# Altium project GD_AirIrDA.PrjPcb
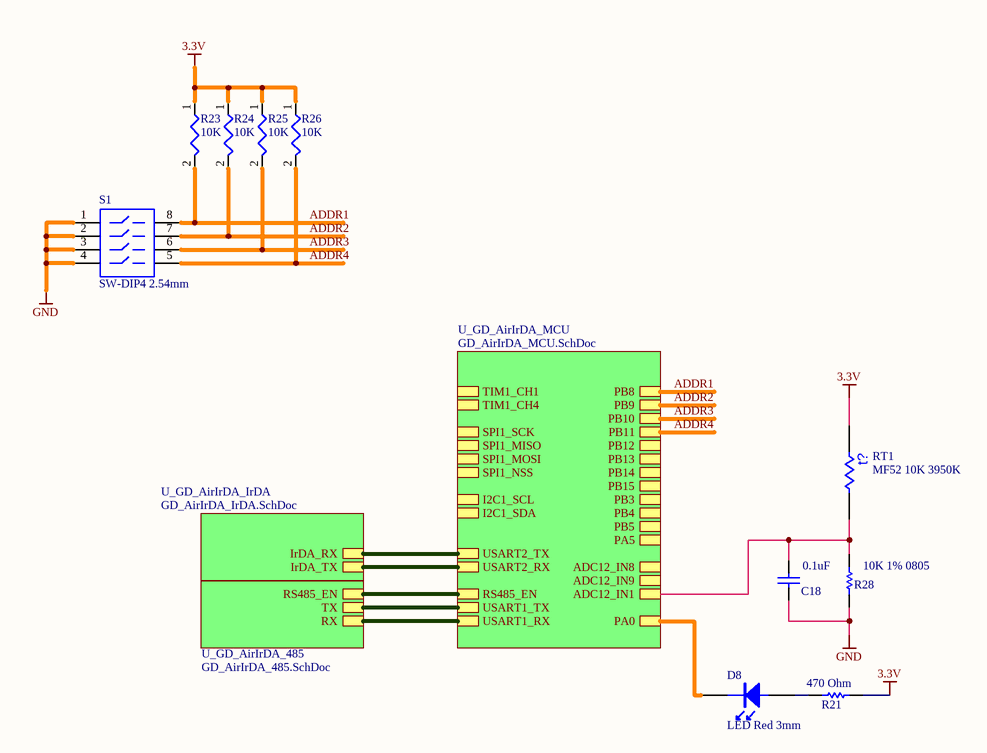
[diagram p0: GD_AirIrDA_Top.SchDoc]
4 sheets, 75 parts. Net scope: hierarchical (ports join the sheet entries above them; power ports are global).
Board file: GD_AirIrDA.PcbDoc
Sheets:
  GD_AirIrDA_Top.SchDoc
    U_GD_AirIrDA_MCU = GD_AirIrDA_MCU.SchDoc
    U_GD_AirIrDA_485 = GD_AirIrDA_485.SchDoc
    U_GD_AirIrDA_IrDA = GD_AirIrDA_IrDA.SchDoc

## Sheet GD_AirIrDA_Top.SchDoc
size A4

### Parts
C18  value 0.1uF  [CAPC0805(2012)100_N]  (hidden comment: CAP 0.1uF 20% 50V 0805)
D8  LED Red 3mm  [LED_DIP]
R21  value 470 Ohm  [RESC0805(2012)_L]  (hidden comment: 470 Ohm 5% 0805)
R23  value 10K  [R0805]  (hidden comment: 10K 5% 0805)
R24  value 10K  [R0805]  (hidden comment: 10K 5% 0805)
R25  value 10K  [R0805]  (hidden comment: 10K 5% 0805)
R26  value 10K  [R0805]  (hidden comment: 10K 5% 0805)
R28  10K 1% 0805  [RESC0805(2012)_L]
RT1  MF52 10K 3950K  [NTC-MF52]
S1  SW-DIP4 2.54mm  [SW_4P]

### Sub-sheets
U_GD_AirIrDA_485 = GD_AirIrDA_485.SchDoc: RS485_EN, TX, RX
U_GD_AirIrDA_IrDA = GD_AirIrDA_IrDA.SchDoc: IrDA_TX, IrDA_RX
U_GD_AirIrDA_MCU = GD_AirIrDA_MCU.SchDoc: USART1_TX, USART1_RX, USART2_TX, USART2_RX, TIM1_CH1, TIM1_CH4, SPI1_SCK, SPI1_MISO, SPI1_MOSI, SPI1_NSS, I2C1_SCL, I2C1_SDA, ADC12_IN8, ADC12_IN9, ADC12_IN1, RS485_EN, PB8, PB9, PB10, PB11, PB12, PB13, PB14, PB15, PB3, PB4, PB5, PA5, PA0

### Nets
3.3V: R21.2 R23.1 R24.1 R25.1 R26.1 RT1.1
GND: C18.1 R28.2 S1.1 S1.2 S1.3 S1.4
ADDR1: R23.2 S1.8 ; sheet U_GD_AirIrDA_MCU/PB8
ADDR2: R24.2 S1.7 ; sheet U_GD_AirIrDA_MCU/PB9
ADDR3: R25.2 S1.6 ; sheet U_GD_AirIrDA_MCU/PB10
ADDR4: R26.2 S1.5 ; sheet U_GD_AirIrDA_MCU/PB11
NetC18_2: C18.2 R28.1 RT1.2 ; sheet U_GD_AirIrDA_MCU/ADC12_IN1
NetD8_1: D8.1 R21.1
NetD8_2: D8.2 ; sheet U_GD_AirIrDA_MCU/PA0
NetR11_2: sheet U_GD_AirIrDA_MCU/RS485_EN, sheet U_GD_AirIrDA_485/RS485_EN
NetR22_2: sheet U_GD_AirIrDA_MCU/USART2_TX, sheet U_GD_AirIrDA_IrDA/IrDA_RX
NetU1_13: sheet U_GD_AirIrDA_MCU/USART2_RX, sheet U_GD_AirIrDA_IrDA/IrDA_TX
NetU1_30: sheet U_GD_AirIrDA_MCU/USART1_TX, sheet U_GD_AirIrDA_485/TX
NetU1_31: sheet U_GD_AirIrDA_MCU/USART1_RX, sheet U_GD_AirIrDA_485/RX

### Notes on the sheet
- (in symbol Res Thermal) t?

### Library data of the parts
C18 = CMP-1036-00070-1: CAP 0.1uF 50V ±20% 0805 (2012 Metric) Thickness 1mm SMD; Case-Metric: 2012; Case-EIA: 0805; Tolerance: 20%; Rated Voltage: 50 V; Technology: SMT; Max Thickness: 1 mm
D8 = LED
R21 = CMP-1013-00098-1: 470Ohm 0.125W 5% 0805 (2012 Metric)  SMD; Case-EIA: 0805; Case-Metric: 2012; Power: 0.125 W; Technology: SMT; Tolerance: 5 %
R23-R26 = ER00213: RES THICK_FILM SMD 10K ohm 5% 1/10W ROHS 0603; Manufacturer: YAGEO; Manufacturer P/N: RC0603JR-1310KL; ID: 213; HelpURL: \\192.168.1.3\Esh\Department\RD\CAD\Component\Resistor\SMD\YAGEO_PYu-RC1206_51_RoHS_L_4.pdf; P/N: ER00213
R28 = CMP-1013-00098-1: 10K 0.125W 5% 0805 (2012 Metric)  SMD; Case-EIA: 0805; Case-Metric: 2012; Value: 10000.00 Ohm; Power: 0.125 W; Technology: SMT; Tolerance: 1 %
RT1 = Res Thermal: Thermistor; Published: 24-Mar-1999; LatestRevisionDate: 29-May-2009; LatestRevisionNote: IPC-7351 Footprint Added.; PackageVersion: Mar-2003; PackageReference: 6-0805; Publisher: Altium Limited; PackageDescription: Chip Resistor 0805 Case Size; Code_IPC: RESC2012
S1 = SW-DIP4: 侧拨 4位; Manufacturer: WE; Manufacturer P/N: 418317270904; P/N: EE00004; Published: 24-Mar-1999; LatestRevisionDate: 17-Jul-2002; LatestRevisionNote: Re-released for DXP Platform.; PackageReference: DIP-8; Publisher: Altium Limited

## Sheet GD_AirIrDA_MCU.SchDoc
size A4
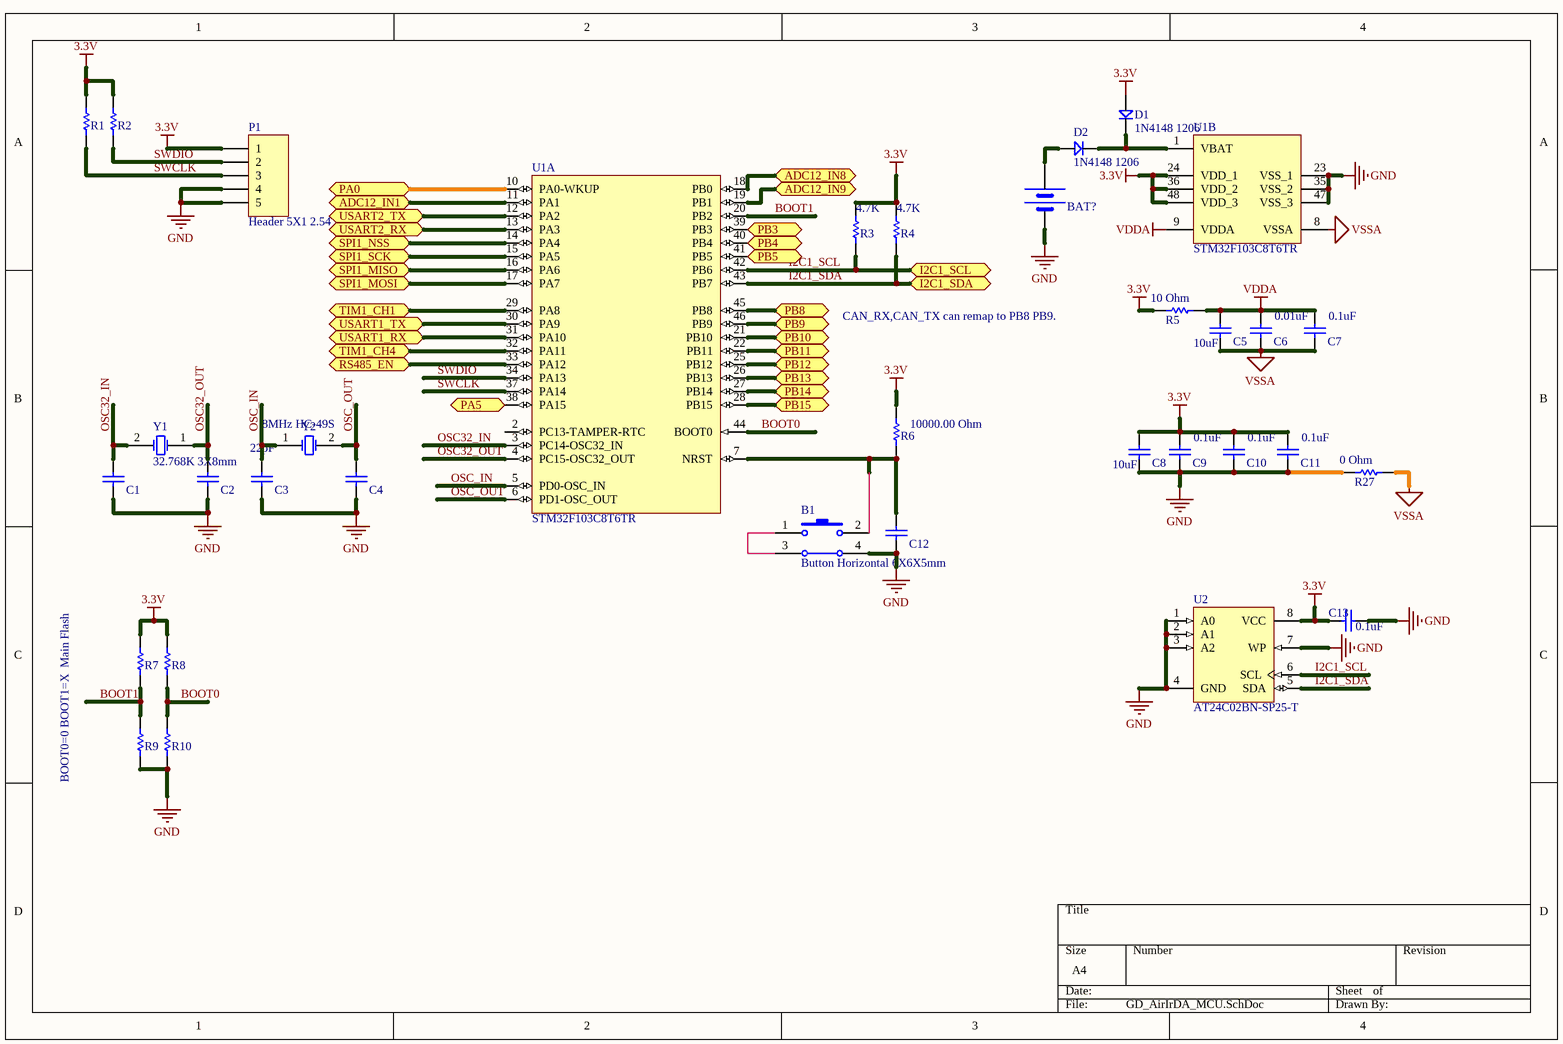
[diagram p1: GD_AirIrDA_MCU.SchDoc]

### Parts
B1  Button Horizontal 6X6X5mm  [Button_V]
BAT?  CR1220 Sockect SMD  [BATM]  (value not drawn)
C1  CAP 22pF 5% 50V 0805  [CAPC0805(2012)75_M]  (value not drawn)
C2  CAP 22pF 5% 50V 0805  [CAPC0805(2012)75_M]  (value not drawn)
C3  value 22pF  [CAPC0805(2012)75_M]  (hidden comment: CAP 22pF 5% 50V 0805)
C4  CAP 22pF 5% 50V 0805  [CAPC0805(2012)75_M]  (value not drawn)
C5  value 10uF  [CAPC1210(3225)170_N]  (hidden comment: CAP 10uF 20% 10V 1210)
C6  value 0.01uF  [CAPC0805(2012)100_N]  (hidden comment: CAP 0.1uF 20% 50V 0805)
C7  value 0.1uF  [CAPC0805(2012)100_N]  (hidden comment: CAP 0.1uF 20% 50V 0805)
C8  value 10uF  [CAPC1210(3225)170_N]  (hidden comment: CAP 10uF 20% 10V 1210)
C9  value 0.1uF  [CAPC0805(2012)100_N]  (hidden comment: CAP 0.1uF 20% 50V 0805)
C10  value 0.1uF  [CAPC0805(2012)100_N]  (hidden comment: CAP 0.1uF 20% 50V 0805)
C11  value 0.1uF  [CAPC0805(2012)100_N]  (hidden comment: CAP 0.1uF 20% 50V 0805)
C12  CAP 0.1uF 20% 50V 0805  [CAPC0805(2012)100_N]  (value not drawn)
C13  value 0.1uF  [CAPC0805(2012)100_N]  (hidden comment: CAP 0.1uF 20% 50V 0805)
D1  1N4148 1206  [DIODE_SOP]
D2  1N4148 1206  [DIODE_SOP]
P1  Header 5X1 2.54  [HDR1X5]
R1  10K 5% 0805  [RESC0805(2012)_L]  (value not drawn)
R2  10K 5% 0805  [RESC0805(2012)_L]  (value not drawn)
R3  value 4.7K  [RESC0805(2012)_L]  (hidden comment: 4.7K 5% 0805)
R4  value 4.7K  [RESC0805(2012)_L]  (hidden comment: 4.7K 5% 0805)
R5  value 10 Ohm  [RESC0805(2012)_L]  (hidden comment: 10Ohm 5% 0805)
R6  value 10000.00 Ohm  [RESC0805(2012)_L]  (hidden comment: 10K 5% 0805)
R7  10K 5% 0805  [RESC0805(2012)_L]  (value not drawn)  (no BOM)
R8  10K 5% 0805  [RESC0805(2012)_L]  (value not drawn)  (no BOM)
R9  10K 5% 0805  [RESC0805(2012)_L]  (value not drawn)  (no BOM)
R10  10K 5% 0805  [RESC0805(2012)_L]  (value not drawn)
R27  value 0 Ohm  [RESC0805(2012)_L]  (hidden comment: 0 Ohm 5% 0805)
U1  STM32F103C8T6TR  [STM-LQFP48_M]  (parts A,B of 2)
U2  AT24C02BN-SP25-T  [8S1_L]
Y1  32.768K 3X8mm  [XTAL32]
Y2  8MHz HC-49S  [XTAL_US]

### Ports
ADC12_IN1, ADC12_IN8, ADC12_IN9, I2C1_SCL, I2C1_SDA, PA0, PA5, PB3, PB4, PB5, PB8, PB9, PB10, PB11, PB12, PB13, PB14, PB15, RS485_EN, SPI1_MISO, SPI1_MOSI, SPI1_NSS, SPI1_SCK, TIM1_CH1, TIM1_CH4, USART1_RX, USART1_TX, USART2_RX, USART2_TX

### Nets
3.3V: C8.2 C9.2 C10.2 C11.2 C13.2 D1.1 P1.1 R1.1 R2.1 R3.1 R4.1 R5.1 R6.1 R7.1 R8.1 U1.24(VDD_1) U1.36(VDD_2) U1.48(VDD_3) U2.8(VCC)
GND: B1.4 BAT?.2(GND) C1.2 C2.1 C3.1 C4.1 C8.1 C9.1 C10.1 C11.1 C12.1 C13.1 P1.4 P1.5 R9.2 R10.2 R27.1 U1.23(VSS_1) U1.35(VSS_2) U1.47(VSS_3) U2.1(A0) U2.2(A1) U2.3(A2) U2.4(GND) U2.7(WP)
VDDA: C5.2 C6.2 C7.2 R5.2 U1.9(VDDA)
VSSA: C5.1 C6.1 C7.1 R27.2 U1.8(VSSA)
ADDR1: U1.45(PB8) ; port PB8
ADDR2: U1.46(PB9) ; port PB9
ADDR3: U1.21(PB10) ; port PB10
ADDR4: U1.22(PB11) ; port PB11
BOOT0: R8.2 R10.1 U1.44(BOOT0)
BOOT1: R7.2 R9.1 U1.20(PB2)
I2C1_SCL: R3.2 U1.42(PB6) U2.6(SCL) ; port I2C1_SCL
I2C1_SDA: R4.2 U1.43(PB7) U2.5(SDA) ; port I2C1_SDA
OSC32_IN: C1.1 U1.3(PC14-OSC32_IN) Y1.2(OSC2)
OSC32_OUT: C2.2 U1.4(PC15-OSC32_OUT) Y1.1(OSC1)
OSC_IN: C3.2 U1.5(PD0-OSC_IN) Y2.1(OSC1)
OSC_OUT: C4.2 U1.6(PD1-OSC_OUT) Y2.2(OSC2)
SWCLK: P1.3 R1.2 U1.37(PA14)
SWDIO: P1.2 R2.2 U1.34(PA13)
NetB1_1: B1.1 B1.3
NetB1_2: B1.2 C12.2 R6.2 U1.7(NRST)
NetBAT?_1: BAT?.1(VCC) D2.1
NetC18_2: U1.11(PA1) ; port ADC12_IN1
NetD1_2: D1.2 D2.2 U1.1(VBAT)
NetD8_2: U1.10(PA0-WKUP) ; port PA0
NetR11_2: U1.33(PA12) ; port RS485_EN
NetR22_2: U1.12(PA2) ; port USART2_TX
NetU1_13: U1.13(PA3) ; port USART2_RX
NetU1_14: U1.14(PA4) ; port SPI1_NSS
NetU1_15: U1.15(PA5) ; port SPI1_SCK
NetU1_16: U1.16(PA6) ; port SPI1_MISO
NetU1_17: U1.17(PA7) ; port SPI1_MOSI
NetU1_18: U1.18(PB0) ; port ADC12_IN8
NetU1_19: U1.19(PB1) ; port ADC12_IN9
NetU1_25: U1.25(PB12) ; port PB12
NetU1_26: U1.26(PB13) ; port PB13
NetU1_27: U1.27(PB14) ; port PB14
NetU1_28: U1.28(PB15) ; port PB15
NetU1_29: U1.29(PA8) ; port TIM1_CH1
NetU1_30: U1.30(PA9) ; port USART1_TX
NetU1_31: U1.31(PA10) ; port USART1_RX
NetU1_32: U1.32(PA11) ; port TIM1_CH4
NetU1_38: U1.38(PA15) ; port PA5
NetU1_39: U1.39(PB3) ; port PB3
NetU1_40: U1.40(PB4) ; port PB4
NetU1_41: U1.41(PB5) ; port PB5

Not connected (* = marked no-connect by the designer): U1 2(PC13-TAMPER-RTC)

### Notes on the sheet
- CAN_RX,CAN_TX can remap to PB8 PB9.
- BOOT0=0 BOOT1=X  Main Flash

### Library data of the parts
B1 = ES00012: Button ON/OFF，11.85MM,DIP-4; Manufacturer P/N: TVSE-21L; Manufacturer: HUA JIE; ID: 12; Value: TVSE-21L; P/N: ES00012; HelpURL: \\192.168.1.3\Esh\Department\RD\CAD\Component\TSVX-X1L规格120214.pdf
BAT? = BAT
C1-C4 = CMP-1036-01234-1: CAP 22pF 50V ±1% 0805 (2012 Metric) Thickness 0.75mm SMD; Case-EIA: 0805; Case-Metric: 2012; Rated Voltage: 50 V; Tolerance: ±1%; Technology: SMT; Max Thickness: 0.75 mm
  C1 C2 C4: Value: 22pF
C5 C8 = CMP-1038-02199-1: CAP 10uF 10V ±20% 1210 (3225 Metric) Thickness 1.7mm SMD; Case-Metric: 3225; Case-EIA: 1210; Technology: SMT; Rated Voltage: 10 V; Tolerance: ±20%; Max Thickness: 1.7 mm
C6 C7 C9-C13 = CMP-1036-00070-1: as C18 on sheet GD_AirIrDA_Top; Tolerance: 20%; Rated Voltage: 50 V; Technology: SMT; Max Thickness: 1 mm
  C12: Value: 0.1uF
D1 D2 = D: 1N4148
P1 = Header 5: Header, 5-Pin; LatestRevisionDate: 17-Jul-2002; LatestRevisionNote: Re-released for DXP Platform.; Publisher: Altium Limited
R1 R2 R7-R10 = CMP-1013-00098-1: as R28 on sheet GD_AirIrDA_Top; Power: 0.125 W; Technology: SMT; Tolerance: 5 %
R3 R4 = CMP-1013-00098-1: 4.7K 0.125W 5% 0805 (2012 Metric)  SMD; Case-EIA: 0805; Case-Metric: 2012; Power: 0.125 W; Technology: SMT; Tolerance: 5 %
R5 R27 = CMP-1013-00098-1: 10Ohm 0.125W 5% 0805 (2012 Metric)  SMD; Case-EIA: 0805; Case-Metric: 2012; Power: 0.125 W; Technology: SMT; Tolerance: 5 %
R6 = CMP-1013-00098-1: 10K 0.125W 5% 0805 (2012 Metric)  SMD; Case-EIA: 0805; Case-Metric: 2012; Power: 0.125 W; Technology: SMT; Tolerance: 5 %
U1 = CMP-0237-00216-3: ARM Cortex-M3 32-bit MCU, 64 KB Flash, 20 KB Internal RAM, 37 I/Os, 48-pin LQFP, -40 to 85 degC, Tape and Reel; A/D Converter: 2x12-bit (10 Channel); Internal RAM Size (kB): 20; Supply Voltage(Vcc) min (V): 2; I/Os (High Current): 37; FLASH Size (Prog) (kB): 64; Operating Frequency(F) (Processor speed) (MHz): 72; Packing: Tape and Reel; PackageReference: LQFP48; ComponentLink2Description: Datasheet; Core: ARM Cortex-M3; ComponentLink3URL: http://www.st.com/st-web-ui/static/active/en/resource/technical/document/datasheet/DM00058181.pdf; ComponentLink1Description: Manufacturer URL; ComponentLink3Description: Package Specification; PartNumber: STM32F103C8T6TR; PackageVersion: Rev. 6, 06/2013; ComponentLink2URL: http://www.st.com/st-web-ui/static/active/en/resource/technical/document/datasheet/CD00161566.pdf; PackageDescription: 48-Pin Low Profile Quad Flat Package, 7 x 7 mm Body, 0.5 mm Pitch; Mounting Technology: Surface Mount; DatasheetVersion: Rev. 16; ComponentLink1URL: http://www.st.com/web/en/home.html
U2 = CMP-0152-00023-1: 2Kbit (256 x 8), 2-wire Bus Automotive Serial EEPROM with full memory Write Protect, 2.5V, 8-Pin SOIC, Tape & Reel; PackageDescription: 8-Lead (0.150" Wide Body), Plastic Gull Wing Small Outline (JEDEC SOIC); Code_IPC: SOIC127P600-8; PackageReference: 8S1; DatasheetVersion: 8517C,  Jan-2009; Code_JEDEC: MS-012-AA; PackageVersion: revC, Mar-2005
Y1 = XTAL_1: 32.768K 3mmX8mm; Published: 8-Jun-2000; LatestRevisionDate: 17-Jul-2002; LatestRevisionNote: Re-released for DXP Platform.; Publisher: Altium Limited
Y2 = XTAL: Published: 8-Jun-2000; LatestRevisionDate: 17-Jul-2002; LatestRevisionNote: Re-released for DXP Platform.; Publisher: Altium Limited

## Sheet GD_AirIrDA_485.SchDoc
size A4
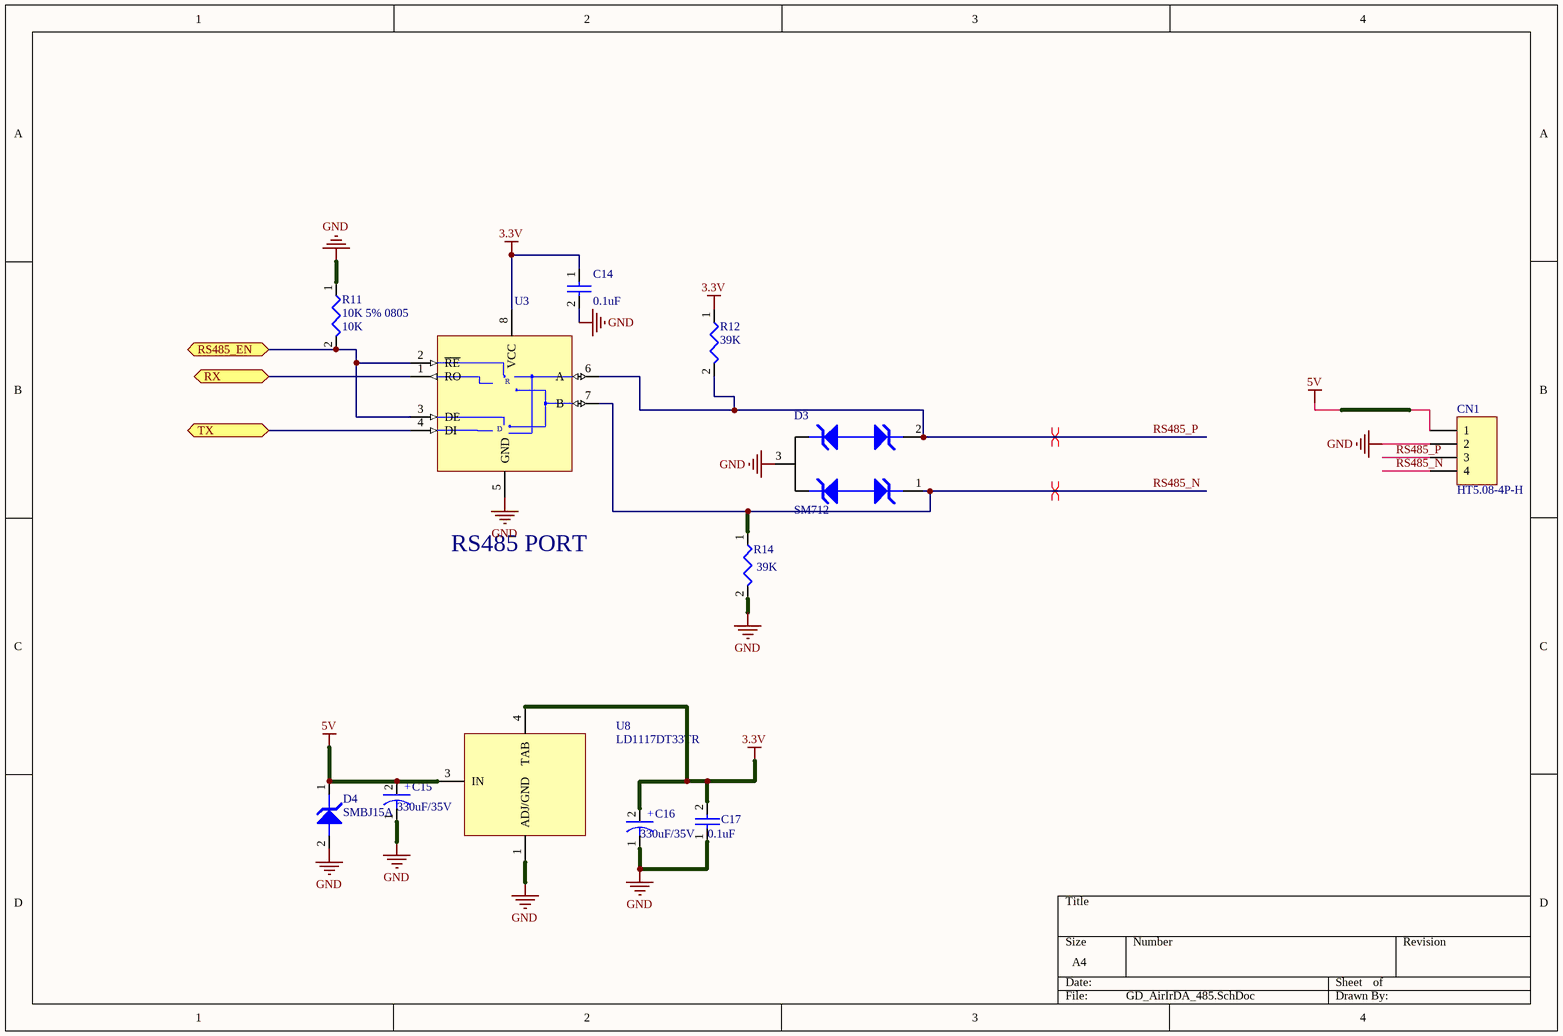
[diagram p2: GD_AirIrDA_485.SchDoc]

### Parts
C14  value 0.1uF  [C0805]  (hidden comment: CAP 0.1uF 20% 50V 0805)
C15  value 330uF/35V  [CA10X16P5]  (hidden comment: CAPACITOR 330uF 20% 35V 10mmX16mm)
C16  value 330uF/35V  [CA10X16P5]  (hidden comment: CAPACITOR 330uF 20% 35V 10mmX16mm)
C17  value 0.1uF  [C0805]  (hidden comment: CAP 0.1uF 20% 50V 0805)
CN1  HT5.08-4P-H  [HT5.08-4P-H]
D3  SM712  [SOT23-123]
D4  SMBJ15A  [SMB]
R11  10K 5% 0805  value 10K  [R0805]
R12  value 39K  [R0805]  (hidden comment: 39K 5% 0805)  (no BOM)
R14  value 39K  [R0805]  (hidden comment: 39K 5% 0805)  (no BOM)
U3  SN65HVD08D  [SOIC8]  (value not drawn)
U8  LD1117DT33TR  [DPAK-134]

### Ports
RS485_EN, RX, TX

### Nets
3.3V: C14.1 C16.2 C17.2 R12.1 U3.8(VCC) U8.4(TAB)
5V: C15.2 CN1.1 D4.1 U8.3(IN)
GND: C14.2 C15.1 C16.1 C17.1 CN1.2 D3.3 D4.2 R11.1 R14.2 U3.5(GND) U8.1(ADJ/GND)
RS485_N: CN1.4 D3.1 R14.1 U3.7(B)
RS485_P: CN1.3 D3.2 R12.2 U3.6(A)
NetR11_2: R11.2 U3.2(~{RE}) U3.3(DE) ; port RS485_EN
NetU1_30: U3.4(DI) ; port TX
NetU1_31: U3.1(RO) ; port RX

### Layout directives
differential pair: RS485_N, RS485_P

### Notes on the sheet
- RS485 PORT
- (in symbol EC00095) +
- (in symbol EU00041) R; D

### Library data of the parts
C14 C17 = EC00014: CAP SMD CR X7R 50V 10% 0.1uF 0805 ROHS; Manufacturer: YAGEO; Manufacturer P/N: CC0805KRX7R9BB104; ID: 14; HelpURL: *; P/N: EC00014
C15 C16 = EC00095: CAP 35V 20% 330uF 10X16X0.6MM ROHS，7000hours; Manufacturer: NIPPON CHEMI-CON; Manufacturer P/N: EKY350ELL331MJ16S; ID: 95; Type: ****; HelpURL: \\192.168.1.3\Esh\Department\RD\CAD\Component\Capacitor\KY(105).pdf; P/N: EC00095
CN1 = Header 4: Header, 4-Pin; Manufacturer P/N: HT5.08-4 Bend; P/N: EE00005; Manufacturer: *
D3 = ED00007: DIODE TVS 7V 12V 17A 400W SOT-23 SMD ROHS; Manufacturer: BOURNS; ID: 7; Value: CDSOT23-SM712; Type: ****; HelpURL: \\192.168.1.3\Esh\Department\RD\CAD\Component\IO_PROTECTION\BOURNS_CDSOT23-SM712.pdf; P/N: ED00007; Manufacturer P/N: CDSOT23-SM712
D4 = ED00032: Manufacturer: Bourns; P/N: EE00002; Type: ****; Manufacturer P/N: SMBJ15A; Value: SMBJ15A
R11 = ER00213: as R23 on sheet GD_AirIrDA_Top; HelpURL: \\192.168.1.3\Esh\Department\RD\CAD\Component\Resistor\SMD\YAGEO_PYu-RC1206_51_RoHS_L_4.pdf; P/N: ER00213
R12 R14 = ER00021: RES THICK_FILM SMD 39K 5% 1/8W ROHS 0805; Manufacturer: YAGEO; Manufacturer P/N: RC0805JR-0739KL; ID: 21; HelpURL: *; P/N: ER00021
U3 = EU00041: IC 5V,RS-485,10Mbps,16KV,TRANSCEIVERS,SOIC-8,ROHS; Manufacturer: Texas Instruments; ID: 41; HelpURL: \\192.168.1.3\Esh\Department\RD\CAD\Component\RS485\sn65hvd08.pdf; P/N: EU00041; Manufacturer P/N: SN65HVD08D; Value: SN65HVD08D; Type: *****
U8 = EU00066: IC REG VOLT +3.3V LDO 800MA DPAK ROHS; Manufacturer: ST; ID: 66; Value: LD1117-3.3; P/N: EU00066; HelpURL: \\192.168.1.3\Esh\Department\RD\CAD\Component\Power_DC_to_DC\LD1117_ST.pdf; Manufacturer P/N: LD1117DT33TR; Type: *****

## Sheet GD_AirIrDA_IrDA.SchDoc
size A4
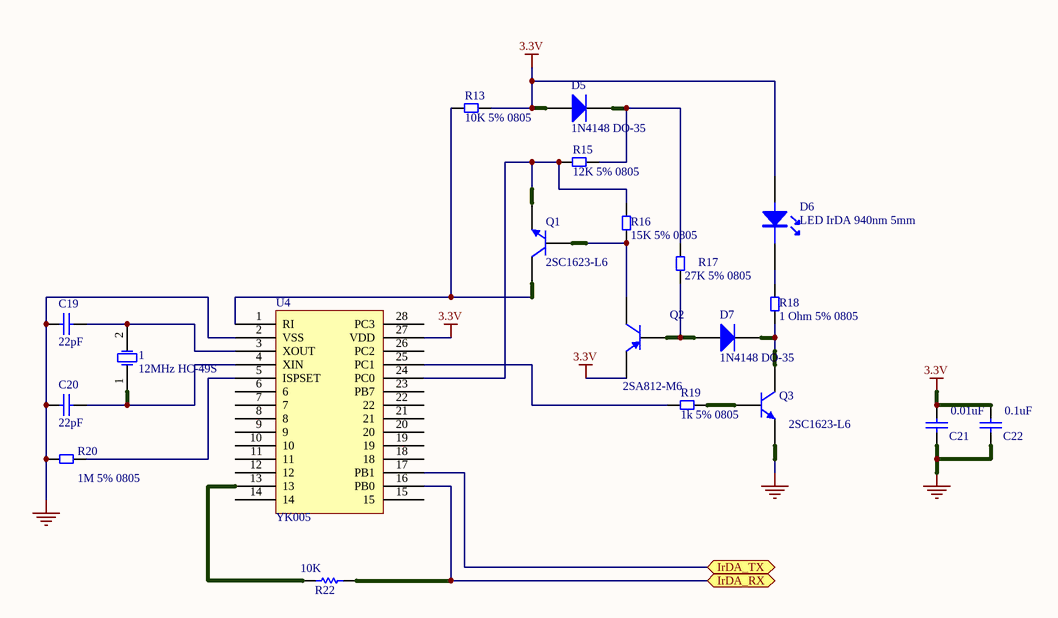
[diagram p3: GD_AirIrDA_IrDA.SchDoc]

### Parts
1  12MHz HC-49S  [XTAL_US]
C19  value 22pF  [CAPC0805(2012)75_M]  (hidden comment: CAP 22pF 5% 50V 0805)
C20  value 22pF  [CAPC0805(2012)75_M]  (hidden comment: CAP 22pF 5% 50V 0805)
C21  value 0.01uF  [CAPC0805(2012)100_N]  (hidden comment: CAP 0.01uF 20% 50V 0805)
C22  value 0.1uF  [CAPC0805(2012)100_N]  (hidden comment: CAP 0.1uF 20% 50V 0805)
D5  1N4148 DO-35  [NXP-SOD27-2_V]
D6  LED IrDA 940nm 5mm  [LED-5.0]
D7  1N4148 DO-35  [NXP-SOD27-2_V]
Q1  2SC1623-L6  [SOT-23B_N]
Q2  2SA812-M6  [SOT-23B_N]
Q3  2SC1623-L6  [SOT-23B_N]
R13  10K 5% 0805  [R0805]
R15  12K 5% 0805  [R0805]
R16  15K 5% 0805  [R0805]
R17  27K 5% 0805  [R0805]
R18  1 Ohm 5% 0805  [R0805]
R19  1k 5% 0805  [R0805]
R20  1M 5% 0805  [R0805]
R22  value 10K  [RESC0805(2012)_L]  (hidden comment: 10K 5% 0805)
U4  YK005  [IR-IC]

### Ports
IrDA_RX, IrDA_TX

### Nets
3.3V: C21.2 C22.2 D5.1(A) D6.1 Q2.3(E) R13.2 U4.27(VDD)
GND: C19.2 C20.2 C21.1 C22.1 Q3.3(E) R20.1 U4.2(VSS)
Net1_1: 1.1(OSC1) C20.1 U4.4(XIN)
Net1_2: 1.2(OSC2) C19.1 U4.3(XOUT)
NetD5_2: D5.2(K) R15.2 R17.2
NetD6_2: D6.2 R18.2
NetD7_1: D7.1(A) Q2.2(B) R17.1
NetD7_2: D7.2(K) Q3.1(C) R18.1
NetQ1_1: Q1.1(C) R13.1 U4.1(RI)
NetQ1_2: Q1.2(B) Q2.1(C) R16.2
NetQ1_3: Q1.3(E) R15.1 R16.1 U4.24(PC0)
NetQ3_2: Q3.2(B) R19.2
NetR19_1: R19.1 U4.25(PC1)
NetR20_2: R20.2 U4.5(ISPSET)
NetR22_1: R22.1 U4.13
NetR22_2: R22.2 U4.16(PB0) ; port IrDA_RX
NetU1_13: U4.17(PB1) ; port IrDA_TX

Not connected (* = marked no-connect by the designer): U4 6 7 8 9 10 11 12 14 15 18 19 20 21 22 23(PB7) 26(PC2) 28(PC3)

### Library data of the parts
1 = XTAL: Published: 8-Jun-2000; LatestRevisionDate: 17-Jul-2002; LatestRevisionNote: Re-released for DXP Platform.; Publisher: Altium Limited
C19 C20 = CMP-1036-01234-1: as C1 on sheet GD_AirIrDA_MCU; Rated Voltage: 50 V; Tolerance: ±1%; Technology: SMT; Max Thickness: 0.75 mm
C21 C22 = CMP-1036-00070-1: as C18 on sheet GD_AirIrDA_Top; Tolerance: 20%; Rated Voltage: 50 V; Technology: SMT; Max Thickness: 1 mm
D5 D7 = CMP-0648-00002-1: High-speed Diode, 100 V, 450 mA, 2-Pin SOD27, RoHS; Manufacturer: NXP Semiconductors; Configuration: Single; IR (VR: 20 V)=25 nA; IFRM: 450 mA; IFSM: 4 A Max.; Trr: 4 ns Max.; Cd: 4 pF Max.; VR: 100 V Max.; VF (IF: 10 mA)=1 V; IF: 200 mA Max.; ComponentLink1Description: Manufacturer URL; RoHS: TRUE; ComponentLink1URL: http://www.nxp.com/; ComponentLink3Description: Package Specification; DatasheetVersion: Aug-04; ComponentLink2Description: Datasheet; PackageVersion: Aug-04; PackageReference: SOD27; ComponentLink3URL: http://www.nxp.com/documents/data_sheet/1N4148_1N4448.pdf; Mounting Technology: Through Hole; ComponentLink2URL: http://www.nxp.com/documents/data_sheet/1N4148_1N4448.pdf; PartNumber: 1N4148; PackageDescription: 2-Pin Hermetically Sealed Glass Package, Axial Leaded, Dia 1.85 mm, Body Length 4.25 mm, Lead Spread 25.4 mm
D6 = LED
Q1 Q3 = QNPN: NPN Bipolar Transistor; Published: 8-Jun-2000; LatestRevisionDate: 29-May-2009; LatestRevisionNote: IPC-7351 Footprint Added.; PackageVersion: Aug-1999; PackageReference: SOT-23B; Publisher: Altium Limited; PackageDescription: 3-Pin SOT-23 Package 0.95 mm Pitch, 2.4 mm Lead Span; Value: 2SC1623-L6
Q2 = PNP: PNP Bipolar Transistor; Published: 8-Jun-2000; LatestRevisionDate: 29-May-2009; LatestRevisionNote: IPC-7351 Footprint Added.; PackageVersion: Aug-1999; PackageReference: SOT-23B; Publisher: Altium Limited; PackageDescription: 3-Pin SOT-23 Package 0.95 mm Pitch, 2.4 mm Lead Span; Value: 2SA812-M6
R13 R15-R20 = RES2
R22 = CMP-1013-00098-1: as R6 on sheet GD_AirIrDA_MCU; Power: 0.125 W; Technology: SMT; Tolerance: 5 %
U4 = KT-003: 福建易控电子

## Nets that join several sheets
3.3V: GD_AirIrDA_Top (6 pins), GD_AirIrDA_MCU (19 pins), GD_AirIrDA_485 (6 pins), GD_AirIrDA_IrDA (7 pins)
GND: GD_AirIrDA_Top (6 pins), GD_AirIrDA_MCU (25 pins), GD_AirIrDA_485 (11 pins), GD_AirIrDA_IrDA (7 pins)
ADDR1: GD_AirIrDA_Top (R23.2 S1.8), GD_AirIrDA_MCU (U1.45)
ADDR2: GD_AirIrDA_Top (R24.2 S1.7), GD_AirIrDA_MCU (U1.46)
ADDR3: GD_AirIrDA_Top (R25.2 S1.6), GD_AirIrDA_MCU (U1.21)
ADDR4: GD_AirIrDA_Top (R26.2 S1.5), GD_AirIrDA_MCU (U1.22)
NetC18_2: GD_AirIrDA_Top (C18.2 R28.1 RT1.2), GD_AirIrDA_MCU (U1.11)
NetD8_2: GD_AirIrDA_Top (D8.2), GD_AirIrDA_MCU (U1.10)
NetR11_2: GD_AirIrDA_MCU (U1.33), GD_AirIrDA_485 (R11.2 U3.2 U3.3)
NetR22_2: GD_AirIrDA_MCU (U1.12), GD_AirIrDA_IrDA (R22.2 U4.16)
NetU1_13: GD_AirIrDA_MCU (U1.13), GD_AirIrDA_IrDA (U4.17)
NetU1_30: GD_AirIrDA_MCU (U1.30), GD_AirIrDA_485 (U3.4)
NetU1_31: GD_AirIrDA_MCU (U1.31), GD_AirIrDA_485 (U3.1)